# Altium schematic sheet ESP32_S3.SchDoc
size A3; SheetNumber: 5; SheetTotal: 5
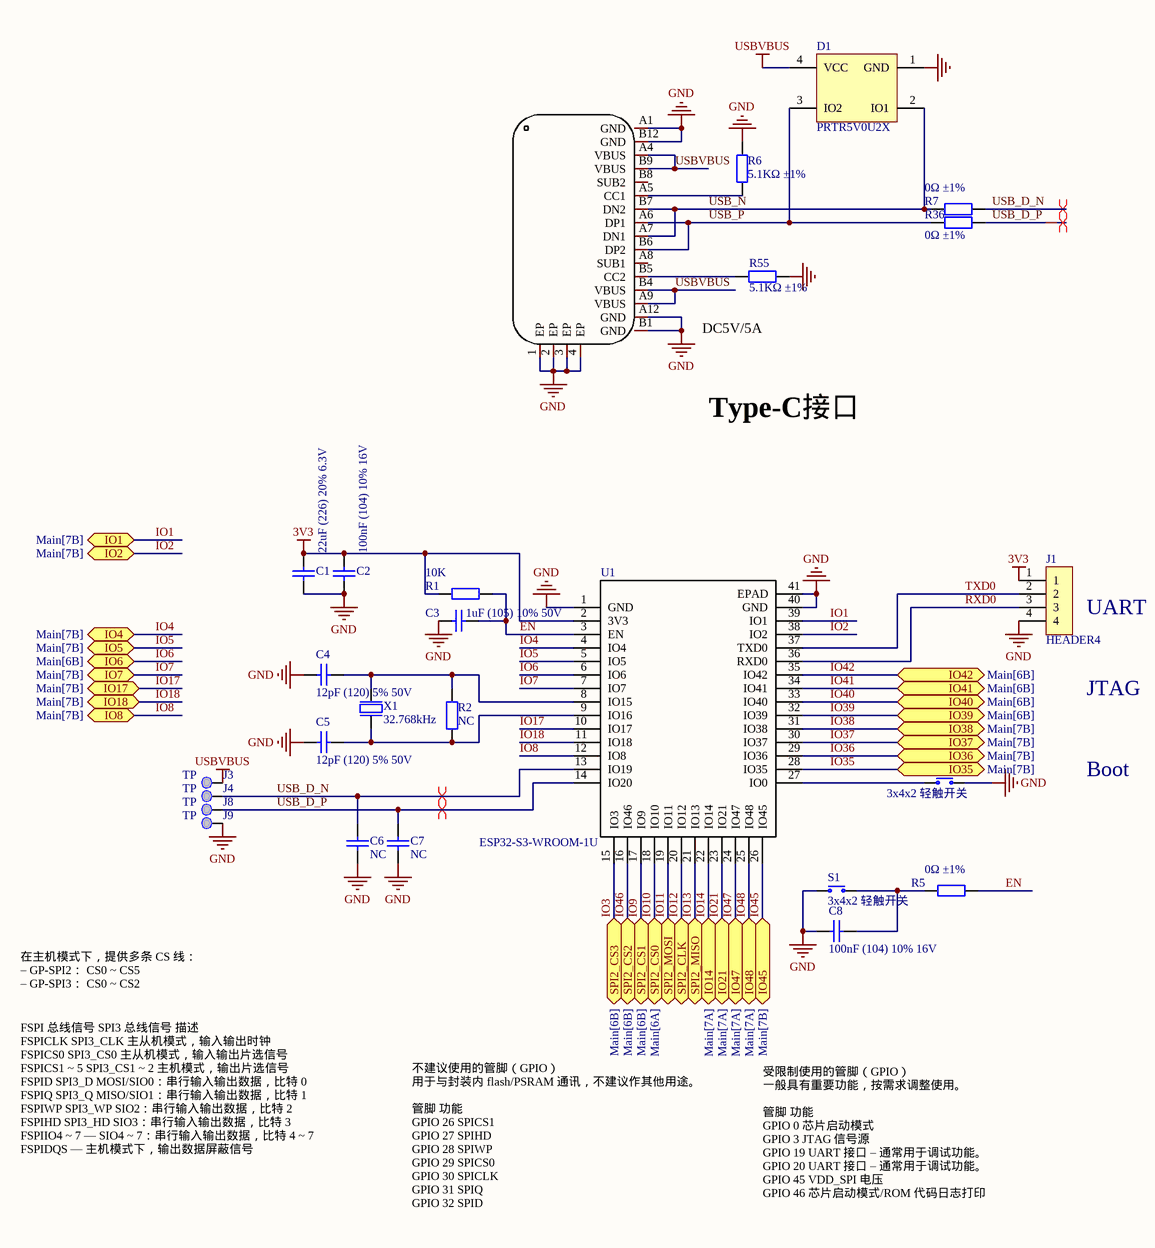
[diagram p0: ESP32_S3.SchDoc]

## Parts
C1  22uF (226) 20% 6.3V  [0402_C]
C2  100nF (104) 10% 16V  [0201_C]
C3  1uF (105) 10% 50V  [0201_C]
C4  12pF (120) 5% 50V  [0201_C]
C5  12pF (120) 5% 50V  [0201_C]
C6  NC  [0402_C]
C7  NC  [0402_C]
C8  100nF (104) 10% 16V  [0201_C]
D1  PRTR5V0U2X  [SOT190P230X110-4L]
J1  HEADER4  [HEADER4_2.54MM_排针]
J3  TP  [TEST_Point]
J4  TP  [TEST_Point]
J8  TP  [TEST_Point]
J9  TP  [TEST_Point]
R1  10K  [0201_R]
R2  NC  [0402_R]
R5  0Ω ±1%  [0402_R]
R6  5.1KΩ ±1%  [0402_R]
R7  0Ω ±1%  [0402_R]
R36  0Ω ±1%  [0402_R]
R55  5.1KΩ ±1%  [0402_R]
S1  3x4x2 轻触开关  [KEY_3x4X2包脚U型]
S3  3x4x2 轻触开关  [KEY_3x4X2包脚U型]
U1  ESP32-S3-WROOM-1U  [WIRELM-SMD_ESP32-S3-WROOM-1U]
USB1  KH-TYPE-C-16P  [USB-C-SMD_KH-TYPE-C-16P]  (value not drawn)
X1  32.768kHz  [XTAL_3215]

## Ports
IO1 (bidir, see Main[7B]), IO2 (bidir, see Main[7B]), IO4 (bidir, see Main[7B]), IO5 (bidir, see Main[7B]), IO6 (bidir, see Main[6B]), IO7 (bidir, see Main[7B]), IO8 (bidir, see Main[7B]), IO14 (bidir, see Main[7A]), IO17 (bidir, see Main[7B]), IO18 (bidir, see Main[7B]), IO21 (bidir, see Main[7A]), IO35 (bidir, see Main[7B]), IO36 (bidir, see Main[7B]), IO37 (bidir, see Main[7B]), IO38 (bidir, see Main[7B]), IO39 (bidir, see Main[6B]), IO40 (bidir, see Main[6B]), IO41 (bidir, see Main[6B]), IO42 (bidir, see Main[6B]), IO45 (bidir, see Main[7B]), IO47 (bidir, see Main[7A]), IO48 (bidir, see Main[7A]), SPI2_CLK (bidir, see Main[6B]), SPI2_CS0 (bidir, see Main[6A]), SPI2_CS1 (bidir, see Main[6B]), SPI2_CS2 (bidir, see Main[6B]), SPI2_CS3 (bidir, see Main[6B]), SPI2_MISO (bidir, see Main[6B]), SPI2_MOSI (bidir, see Main[6B])

## Nets
3V3: C1.2 C2.2 J1.1 R1.2 U1.2(3V3)
GND: C1.1 C2.1 C3.1 C4.1 C5.1 C6.1 C7.1 C8.2 D1.1(GND) J1.4 J9.1 R6.1 R55.2 S1.2 S3.1 U1.1(GND) U1.40(GND) U1.41(EPAD) USB1.1(EP) USB1.2(EP) USB1.3(EP) USB1.4(EP) USB1.A1(GND) USB1.A12(GND) USB1.B1(GND) USB1.B12(GND)
USBVBUS: D1.4(VCC) J3.1 USB1.A4(VBUS) USB1.A9(VBUS) USB1.B4(VBUS) USB1.B9(VBUS)
EN: C3.2 R1.1 R5.2 U1.3(EN)
IO1: U1.39(IO1) ; port IO1
IO2: U1.38(IO2) ; port IO2
IO3: U1.15(IO3) ; port SPI2_CS3
IO4: U1.4(IO4) ; port IO4
IO5: U1.5(IO5) ; port IO5
IO6: U1.6(IO6) ; port IO6
IO7: U1.7(IO7) ; port IO7
IO8: U1.12(IO8) ; port IO8
IO9: U1.17(IO9) ; port SPI2_CS1
IO10: U1.18(IO10) ; port SPI2_CS0
IO11: U1.19(IO11) ; port SPI2_MOSI
IO12: U1.20(IO12) ; port SPI2_CLK
IO13: U1.21(IO13) ; port SPI2_MISO
IO14: U1.22(IO14) ; port IO14
IO17: U1.10(IO17) ; port IO17
IO18: U1.11(IO18) ; port IO18
IO21: U1.23(IO21) ; port IO21
IO35: U1.28(IO35) ; port IO35
IO36: U1.29(IO36) ; port IO36
IO37: U1.30(IO37) ; port IO37
IO38: U1.31(IO38) ; port IO38
IO39: U1.32(IO39) ; port IO39
IO40: U1.33(IO40) ; port IO40
IO41: U1.34(IO41) ; port IO41
IO42: U1.35(IO42) ; port IO42
IO45: U1.26(IO45) ; port IO45
IO46: U1.16(IO46) ; port SPI2_CS2
IO47: U1.24(IO47) ; port IO47
IO48: U1.25(IO48) ; port IO48
RXD0: J1.3 U1.36(RXD0)
TXD0: J1.2 U1.37(TXD0)
USB_D_N: C6.2 J4.1 R7.2 U1.13(IO19)
USB_D_P: C7.2 J8.1 R36.2 U1.14(IO20)
USB_N: D1.2(IO1) R7.1 USB1.A7(DN1) USB1.B7(DN2)
USB_P: D1.3(IO2) R36.1 USB1.A6(DP1) USB1.B6(DP2)
NetC4_2: C4.2 R2.2 U1.8(IO15) X1.1(inp)
NetC5_2: C5.2 R2.1 U1.9(IO16) X1.2(out)
NetC8_1: C8.1 R5.1 S1.1
NetR6_2: R6.2 USB1.A5(CC1)
NetR55_1: R55.1 USB1.B5(CC2)
NetS3_2: S3.2 U1.27(IO0)

Not connected (* = marked no-connect by the designer): USB1 A8(SUB1) B8(SUB2)

## Layout directives
differential pair; differential pair class USB; net class USB: USB_D_N, USB_D_P

## Notes on the sheet
- DC5V/5A
- Type-C接口
- (near J1) UART
- JTAG
- Boot
- 在主机模式下，提供多条 CS 线：
  – GP­SPI2： CS0 ~ CS5
  – GP­SPI3： CS0 ~ CS2
- FSPI 总线信号 SPI3 总线信号 描述
  FSPICLK SPI3_CLK 主从机模式，输入输出时钟
  FSPICS0 SPI3_CS0 主从机模式，输入输出片选信号
  FSPICS1 ~ 5 SPI3_CS1 ~ 2 主机模式，输出片选信号
  FSPID SPI3_D MOSI/SIO0：串行输入输出数据，比特 0
  FSPIQ SPI3_Q MISO/SIO1：串行输入输出数据，比特 1
  FSPIWP SPI3_WP SIO2：串行输入输出数据，比特 2
  FSPIHD SPI3_HD SIO3：串行输入输出数据，比特 3
  FSPIIO4 ~ 7 — SIO4 ~ 7：串行输入输出数据，比特 4 ~ 7
  FSPIDQS — 主机模式下，输出数据屏蔽信号
- 不建议使用的管脚（GPIO）
  用于与封装内 flash/PSRAM 通讯，不建议作其他用途。
  管脚	功能
  GPIO 26	SPICS1
  GPIO 27	SPIHD
  GPIO 28	SPIWP
  GPIO 29	SPICS0
  GPIO 30	SPICLK
  GPIO 31	SPIQ
  GPIO 32	SPID
- 受限制使用的管脚（GPIO）
  一般具有重要功能，按需求调整使用。
  管脚	功能
  GPIO 0	芯片启动模式
  GPIO 3	JTAG 信号源
  GPIO 19	UART 接口 – 通常用于调试功能。
  GPIO 20	UART 接口 – 通常用于调试功能。
  GPIO 45	VDD_SPI 电压
  GPIO 46	芯片启动模式/ROM 代码日志打印

## Library data of the parts
C1 = 0603 22uF (226) 20% 6.3V: 贴片电容; ComponentLink1Description: 供应商链接; ComponentLink1URL: http://www.szlcsc.com/product/details_60514.html; Package: 0603; Supplier: LC; SuppliersPartNumber: C59461
C2 C8 = 0402 100nF (104) 10% 16V: 贴片电容; ComponentLink1Description: 供应商链接; ComponentLink1URL: http://www.szlcsc.com/product/details_1877.html; Package: 0402; Supplier: LC; SuppliersPartNumber: C1525
C3 = 0603 1uF (105) 10% 50V: 贴片电容; ComponentLink1Description: 供应商链接; ComponentLink1URL: http://www.szlcsc.com/product/details_16531.html; Package: 0603; Supplier: LC; SuppliersPartNumber: C15849
C4-C7 = 0402 12pF (120) 5% 50V: 贴片电容; ComponentLink1Description: 供应商链接; ComponentLink1URL: http://www.szlcsc.com/product/details_1899.html; Package: 0402; Supplier: LC; SuppliersPartNumber: C1547
D1 = PRTR5V0U2X: Ultra low capacitance double rail-to-rail ESD protection diode; Manufacturer: NXP; 2nd source part number: 152-4157; Artikkelnr Noca: 10069015; Artikkelnr Simpro: N.A.; Part Number: PRTR5V0U2X; Manufacturer Part Number: PRTR5V0U2X; Datasheet: http://www.farnell.com/datasheets/109718.pdf; LatestRevisionDate: 2012-06-11; Publisher: Nordic Semiconductor; Published: 2012-06-11; Value: PRTR5V0U2X; Note: *; Supplier: Digi-Key; Supplier part number: 568-4140-1-ND; 2nd source Supplier: Farnell; Footprint Doc: SOT-143B
J3 J4 J8 J9 = TestPad: Add into BOM: yes
R1 R2 = 0402 10KΩ (1002) 1%: 贴片电阻; ComponentLink1Description: 供应商链接; ComponentLink1URL: http://www.szlcsc.com/product/details_26487.html; Package: 0402; Supplier: LC; SuppliersPartNumber: C25744
R5 = 0402 0Ω (0R0) 1%: 贴片电阻; ComponentLink1Description: 供应商链接; ComponentLink1URL: http://www.szlcsc.com/product/details_17853.html; Package: 0402; Supplier: LC; SuppliersPartNumber: C17168
R6 R55 = 0402 5.1KΩ (5101) 1%: 贴片电阻; Add into BOM: yes; Supplier: LC; SuppliersPartNumber: C25905
R7 R36 = 0402 0Ω (0R0) 1%: 贴片电阻; Add into BOM: yes; Supplier: LC; SuppliersPartNumber: C17168
S1 S3 = SW-PB_包脚U型小乌龟: Add into BOM: yes; 供应商链接: https://item.szlcsc.com/6227348.html
USB1 = KH-TYPE-C-16P: Add into BOM: yes; Supplier: LCSC; 供应商链接: https://item.szlcsc.com/747093.html
X1 = XTAL_SMD3215_32.768kHz_9pF_General: XTAL SMD 3215, 32.768kHz, Cl=9pF, Total Tol: ±50ppm; Pad Count: 2; Part Number: XTAL_SMD3215_32.768kHz_9pF_General; LatestRevisionDate: 2016-08-19; Published: 2016-08-19; Value: 32.768kHz; Footprint Doc: XTAL_3215